# Altium schematic sheet IHM.SchDoc: ENTREES ET SORTIES IHM
size A4; CheckedBy: P. FISCHER; Author: P. FISCHER; CompanyName: LE GROUPE DE 5; DrawnBy: Y. NAIT et P. FISCHER; DocumentNumber: SCH_CARTE_MONITORING_PERMANENT_0; Revision: A.0; SheetNumber: 4; SheetTotal: 7
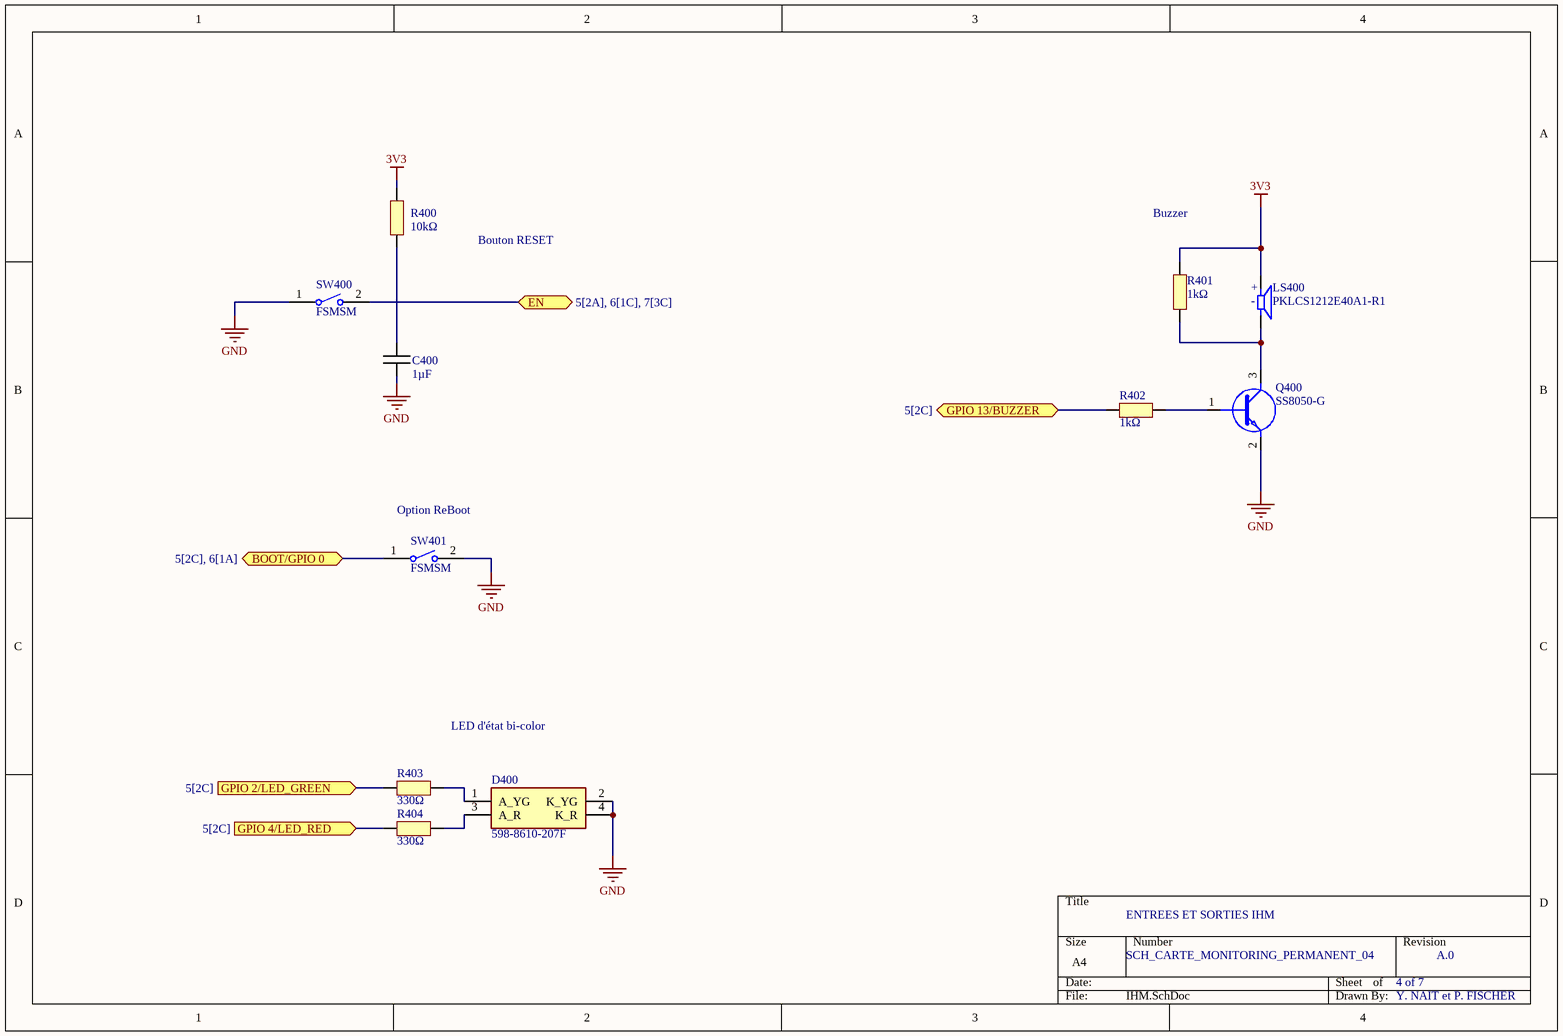
[diagram p0: IHM.SchDoc]

## Parts
C400  1µF  [CAPC1005X06N]
D400  598-8610-207F  [5988610207F]
LS400  PKLCS1212E40A1-R1  [SPKR_PKLCS1212E40A1-R1]
Q400  SS8050-G  [SS8050-G]
R400  10kΩ  [RESC1005X06N]
R401  1kΩ  [RESC1005X06N]
R402  1kΩ  [RESC1005X06N]
R403  330Ω  [RESC1005X06N]
R404  330Ω  [RESC1005X06N]
SW400  FSMSM  [TECO-FSMSM-2_V]
SW401  FSMSM  [TECO-FSMSM-2_V]

## Ports
BOOT/GPIO 0 (bidir, see 5[2C], 6[1A]), EN (bidir, see 5[2A], 6[1C], 7[3C]), GPIO 2/LED_GREEN (in, see 5[2C]), GPIO 4/LED_RED (in, see 5[2C]), GPIO 13/BUZZER (bidir, see 5[2C])

## Nets
3V3: LS400.P R400.2 R401.2
GND: C400.2 D400.2(K_YG) D400.4(K_R) Q400.2(E) SW400.1 SW401.2
BOOT/GPIO 0: SW401.1 ; port BOOT/GPIO 0
EN: SW400.2 ; port EN
GPIO 2/LED_GREEN: R403.1 ; port GPIO 2/LED_GREEN
GPIO 4/LED_RED: R404.1 ; port GPIO 4/LED_RED
GPIO 13/BUZZER: R402.1 ; port GPIO 13/BUZZER
NetC400_1: C400.1 R400.1
NetD400_1: D400.1(A_YG) R403.2
NetD400_3: D400.3(A_R) R404.2
NetLS400_N: LS400.N Q400.3(C) R401.1
NetQ400_1: Q400.1(B) R402.2

## Notes on the sheet
- Bouton RESET
- Buzzer
- (near SW401) Option ReBoot
- LED d'état bi-color
- (in symbol PKLCS1212E40A1-R1) +; -

## Library data of the parts
C400 = Capacitor
D400 = 598-8610-207F: Standard LEDs - SMD Red/Green WC 80/50mcd 645/570nm; Manufacturer_Name: Dialight; Geometry.Height: 0.8mm; Manufacturer_Part_Number: 598-8610-207F; Mouser Part Number: 645-598-8610-207F; Mouser Price/Stock: https://www.mouser.co.uk/ProductDetail/Dialight/598-8610-207F?qs=7JStj%2FjQ2SFuCjosqwklHQ%3D%3D; Arrow Part Number: 598-8610-207F; Arrow Price/Stock: https://www.arrow.com/en/products/598-8610-207f/dialight?region=nac; Datasheet Link: https://media.digikey.com/pdf/Data%20Sheets/Dialight%20PDFs/598%20Series%201210%20Pkg%20Bi-Color.pdf
LS400 = PKLCS1212E40A1-R1: Buzzers Transducer, Externally Driven Piezo 1.5V 2kHz 70dB @ 1.5V, 10cm Surface Mount Solder Pads; MF: Murata Electronics; Value: *; MP: PKLCS1212E40A1-R1; Package: None; Availability: Unavailable; Price: None
Q400 = SS8050-G: Bipolar Transistors - BJT NPN TRANSISTOR 1.5A 40V
R400-R404 = Resistor
SW400 SW401 = CMP-2000-07511-1: FSMSM Push Button Switch, 50 mA, -35 to 85 degC, 2-Pin SMD, RoHS, Bulk; Manufacturer: TE Connectivity; Actuator Length: 1.07mm; Electrical Life: 20000Cycles; Actuator Material: Polyamide; Current Rating: 50mA; Illumination Type: Illuminated; Voltage Rating (DC): 24V; Contact Resistance: 100mOhm; Case\/Package: SMD/SMT; Operating Force: 180gf; Switch Travel: 0.25mm; Max Voltage Rating (DC): 12V; Throw Configuration: SPST; Packaging: LoosePiece; Max Operating Temperature: 85degC; ELV: Compliant; Package Description: 2-Pin Surface Mount Device, Body 6 x 3.5 mm, Pitch 9.19 mm; RoHSCompliant: true; Manufacturer URL: http://www.te.com/; Contact Plating: Silver; Contact Material: Brass; Mounting Technology: SurfaceMount; Contact Current Rating: 50mA; Datasheet Version: Rev. C2, 08/2014; Datasheet URL: http://www.te.com/commerce/DocumentDelivery/DDEController?Action=showdoc&DocId=Customer+Drawing%7F1437566-3%7FC2%7Fpdf%7FEnglish%7FENG_CD_1437566-3_C2_1437566_3_1_c.dwg.pdf%7F1437566-3; Mechanical Life: 20000Cycles; Package Reference: FSMSM; REACH SVHC: Unknown; Orientation: Straight; Min Operating Temperature: -35degC; Lead Free: LeadFree; Termination: GullWing; Package Quantity: 1000; Mount: SurfaceMount